# Altium schematic sheet decoupling.SchDoc
size A2
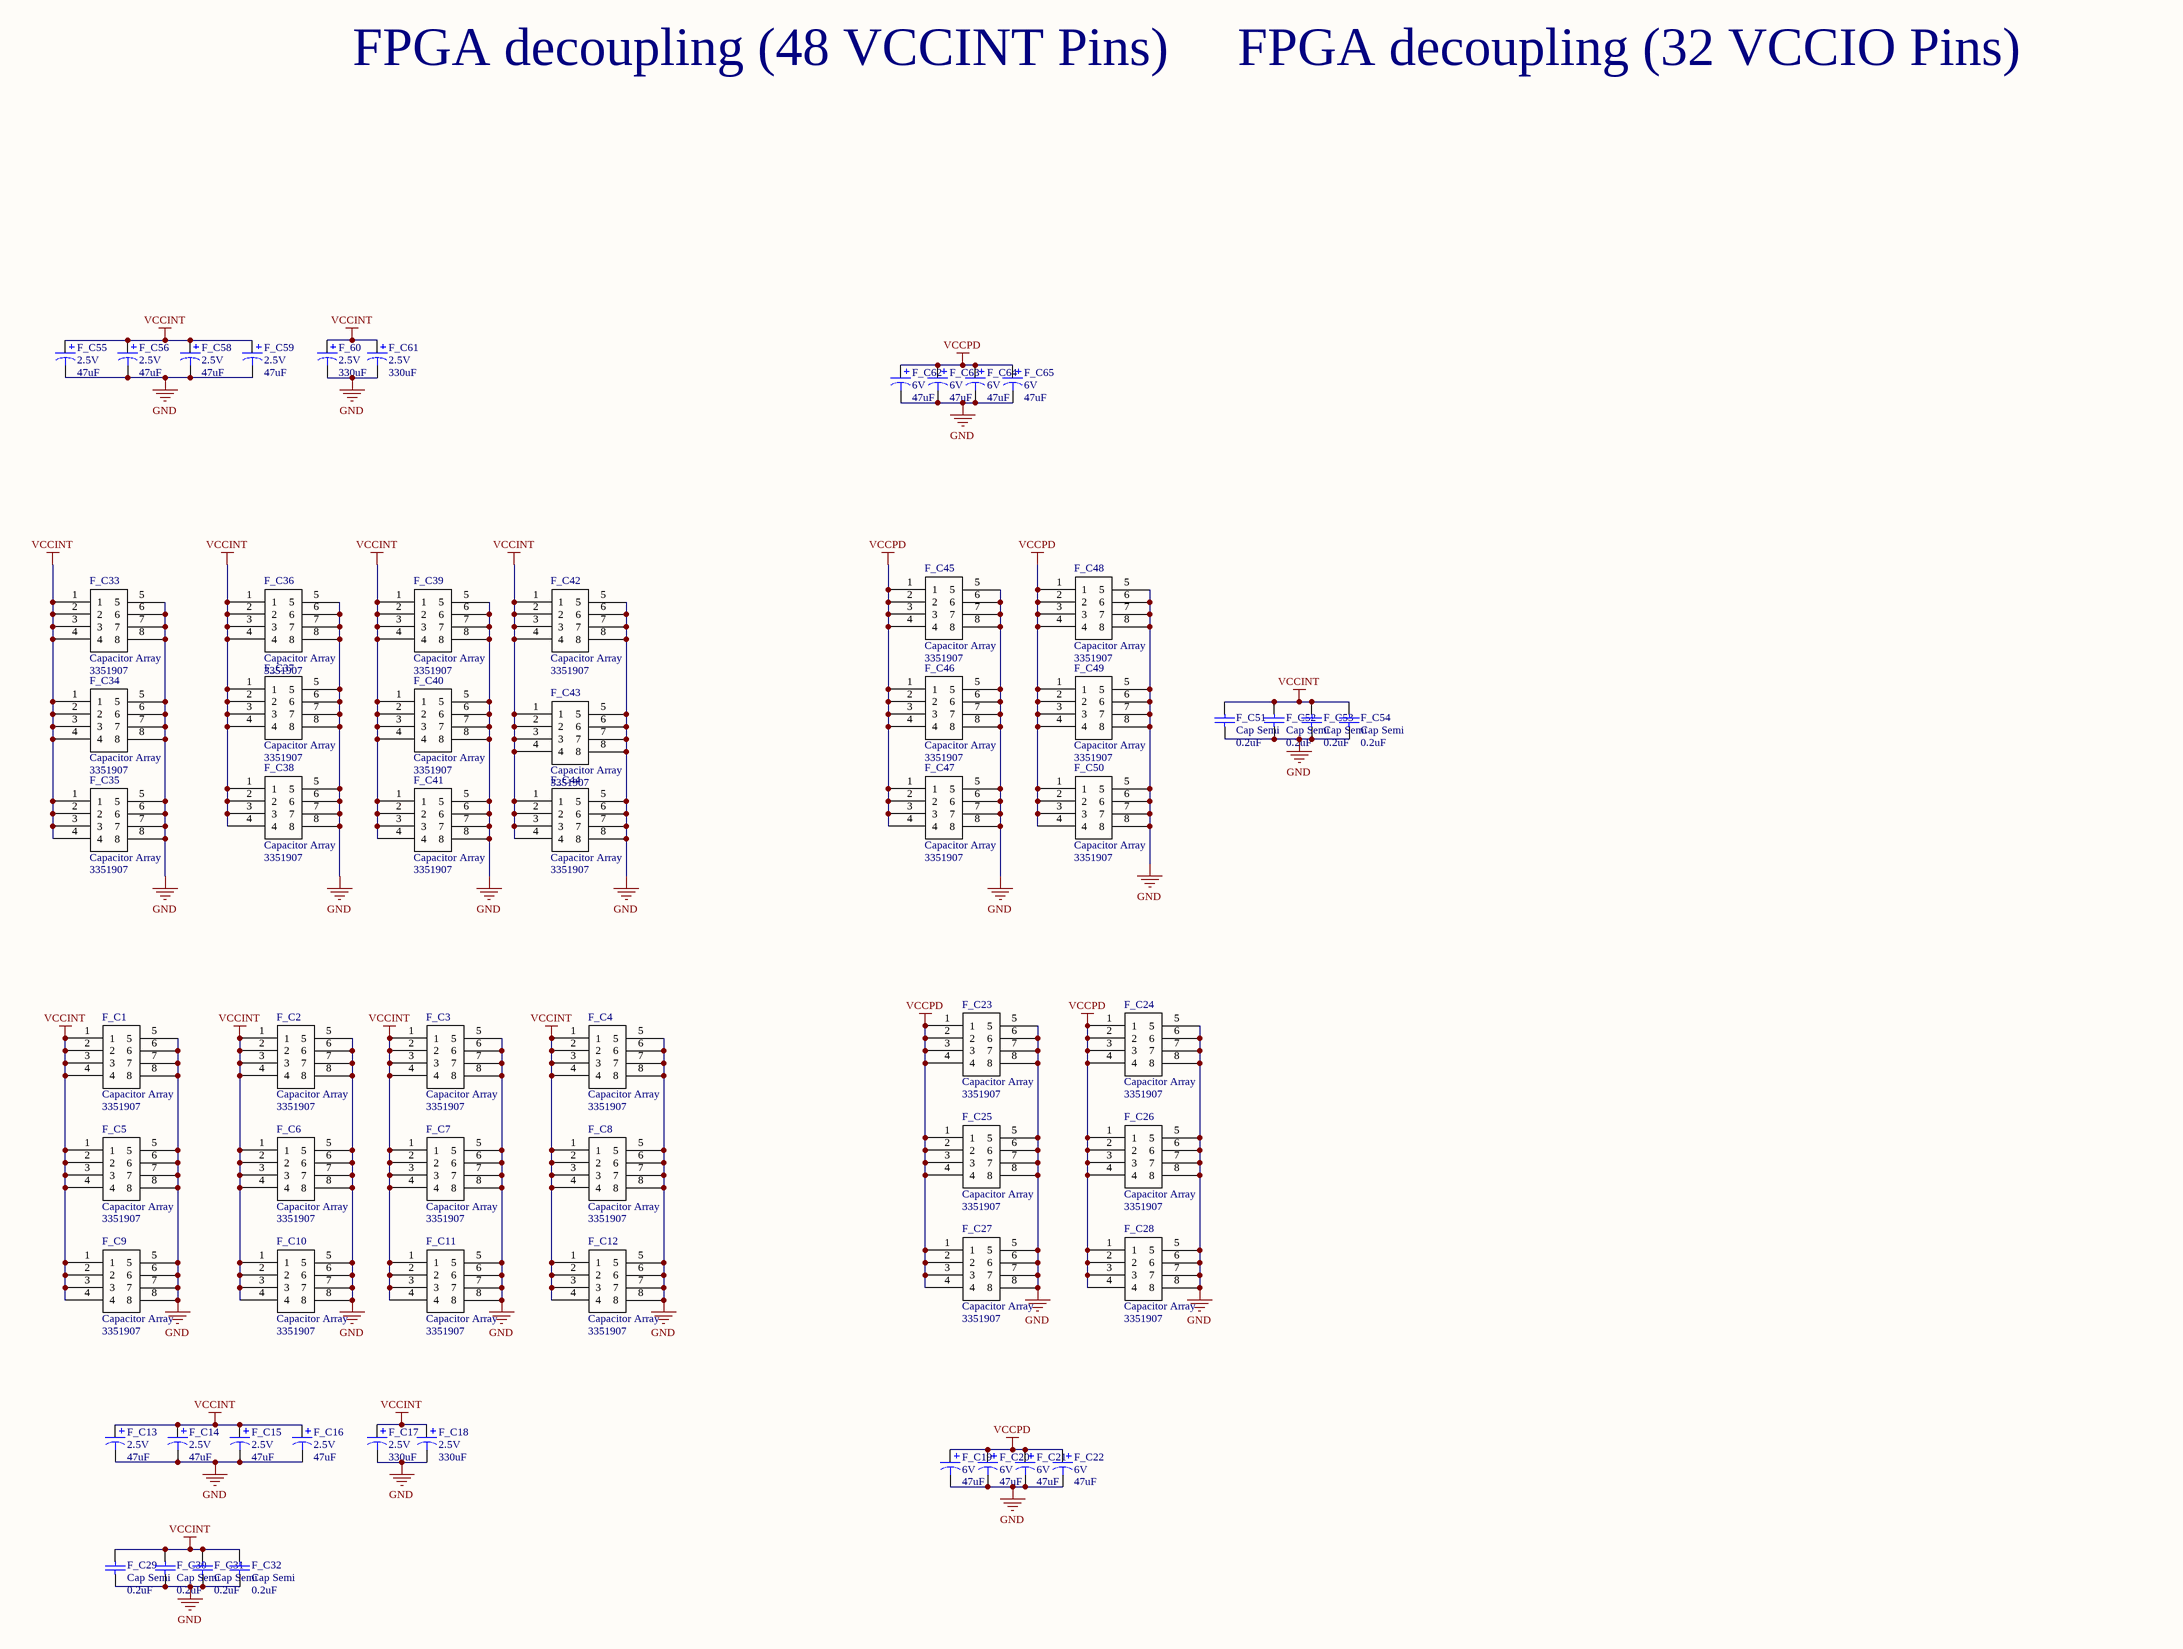
[diagram p0: decoupling.SchDoc]

## Parts
F_60  2.5V  value 330uF  [E]
F_C1  Capacitor Array  Supplier Part Number 1: 3351907  [0612 Array]
F_C2  Capacitor Array  Supplier Part Number 1: 3351907  [0612 Array]
F_C3  Capacitor Array  Supplier Part Number 1: 3351907  [0612 Array]
F_C4  Capacitor Array  Supplier Part Number 1: 3351907  [0612 Array]
F_C5  Capacitor Array  Supplier Part Number 1: 3351907  [0612 Array]
F_C6  Capacitor Array  Supplier Part Number 1: 3351907  [0612 Array]
F_C7  Capacitor Array  Supplier Part Number 1: 3351907  [0612 Array]
F_C8  Capacitor Array  Supplier Part Number 1: 3351907  [0612 Array]
F_C9  Capacitor Array  Supplier Part Number 1: 3351907  [0612 Array]
F_C10  Capacitor Array  Supplier Part Number 1: 3351907  [0612 Array]
F_C11  Capacitor Array  Supplier Part Number 1: 3351907  [0612 Array]
F_C12  Capacitor Array  Supplier Part Number 1: 3351907  [0612 Array]
F_C13  2.5V  value 47uF  [C]
F_C14  2.5V  value 47uF  [C]
F_C15  2.5V  value 47uF  [C]
F_C16  2.5V  value 47uF  [C]
F_C17  2.5V  value 330uF  [E]
F_C18  2.5V  value 330uF  [E]
F_C19  6V  value 47uF  [C]
F_C20  6V  value 47uF  [C]
F_C21  6V  value 47uF  [C]
F_C22  6V  value 47uF  [C]
F_C23  Capacitor Array  Supplier Part Number 1: 3351907  [0612 Array]
F_C24  Capacitor Array  Supplier Part Number 1: 3351907  [0612 Array]
F_C25  Capacitor Array  Supplier Part Number 1: 3351907  [0612 Array]
F_C26  Capacitor Array  Supplier Part Number 1: 3351907  [0612 Array]
F_C27  Capacitor Array  Supplier Part Number 1: 3351907  [0612 Array]
F_C28  Capacitor Array  Supplier Part Number 1: 3351907  [0612 Array]
F_C29  Cap Semi  value 0.2uF  [CAPC1608L]
F_C30  Cap Semi  value 0.2uF  [CAPC1608L]
F_C31  Cap Semi  value 0.2uF  [CAPC1608L]
F_C32  Cap Semi  value 0.2uF  [CAPC1608L]
F_C33  Capacitor Array  Supplier Part Number 1: 3351907  [0612 Array]
F_C34  Capacitor Array  Supplier Part Number 1: 3351907  [0612 Array]
F_C35  Capacitor Array  Supplier Part Number 1: 3351907  [0612 Array]
F_C36  Capacitor Array  Supplier Part Number 1: 3351907  [0612 Array]
F_C37  Capacitor Array  Supplier Part Number 1: 3351907  [0612 Array]
F_C38  Capacitor Array  Supplier Part Number 1: 3351907  [0612 Array]
F_C39  Capacitor Array  Supplier Part Number 1: 3351907  [0612 Array]
F_C40  Capacitor Array  Supplier Part Number 1: 3351907  [0612 Array]
F_C41  Capacitor Array  Supplier Part Number 1: 3351907  [0612 Array]
F_C42  Capacitor Array  Supplier Part Number 1: 3351907  [0612 Array]
F_C43  Capacitor Array  Supplier Part Number 1: 3351907  [0612 Array]
F_C44  Capacitor Array  Supplier Part Number 1: 3351907  [0612 Array]
F_C45  Capacitor Array  Supplier Part Number 1: 3351907  [0612 Array]
F_C46  Capacitor Array  Supplier Part Number 1: 3351907  [0612 Array]
F_C47  Capacitor Array  Supplier Part Number 1: 3351907  [0612 Array]
F_C48  Capacitor Array  Supplier Part Number 1: 3351907  [0612 Array]
F_C49  Capacitor Array  Supplier Part Number 1: 3351907  [0612 Array]
F_C50  Capacitor Array  Supplier Part Number 1: 3351907  [0612 Array]
F_C51  Cap Semi  value 0.2uF  [CAPC1608L]
F_C52  Cap Semi  value 0.2uF  [CAPC1608L]
F_C53  Cap Semi  value 0.2uF  [CAPC1608L]
F_C54  Cap Semi  value 0.2uF  [CAPC1608L]
F_C55  2.5V  value 47uF  [C]
F_C56  2.5V  value 47uF  [C]
F_C58  2.5V  value 47uF  [C]
F_C59  2.5V  value 47uF  [C]
F_C61  2.5V  value 330uF  [E]
F_C62  6V  value 47uF  [C]
F_C63  6V  value 47uF  [C]
F_C64  6V  value 47uF  [C]
F_C65  6V  value 47uF  [C]

## Nets
GND: F_60.2 F_C1.5 F_C1.6 F_C1.7 F_C1.8 F_C2.5 F_C2.6 F_C2.7 F_C2.8 F_C3.5 F_C3.6 F_C3.7 F_C3.8 F_C4.5 F_C4.6 F_C4.7 F_C4.8 F_C5.5 F_C5.6 F_C5.7 F_C5.8 F_C6.5 F_C6.6 F_C6.7 F_C6.8 F_C7.5 F_C7.6 F_C7.7 F_C7.8 F_C8.5 F_C8.6 F_C8.7 F_C8.8 F_C9.5 F_C9.6 F_C9.7 F_C9.8 F_C10.5 F_C10.6 F_C10.7 F_C10.8 F_C11.5 F_C11.6 F_C11.7 F_C11.8 F_C12.5 F_C12.6 F_C12.7 F_C12.8 F_C13.2 F_C14.2 F_C15.2 F_C16.2 F_C17.2 F_C18.2 F_C19.2 F_C20.2 F_C21.2 F_C22.2 F_C23.5 F_C23.6 F_C23.7 F_C23.8 F_C24.5 F_C24.6 F_C24.7 F_C24.8 F_C25.5 F_C25.6 F_C25.7 F_C25.8 F_C26.5 F_C26.6 F_C26.7 F_C26.8 F_C27.5 F_C27.6 F_C27.7 F_C27.8 F_C28.5 F_C28.6 F_C28.7 F_C28.8 F_C29.2 F_C30.2 F_C31.2 F_C32.2 F_C33.5 F_C33.6 F_C33.7 F_C33.8 F_C34.5 F_C34.6 F_C34.7 F_C34.8 F_C35.5 F_C35.6 F_C35.7 F_C35.8 F_C36.5 F_C36.6 F_C36.7 F_C36.8 F_C37.5 F_C37.6 F_C37.7 F_C37.8 F_C38.5 F_C38.6 F_C38.7 F_C38.8 F_C39.5 F_C39.6 F_C39.7 F_C39.8 F_C40.5 F_C40.6 F_C40.7 F_C40.8 F_C41.5 F_C41.6 F_C41.7 F_C41.8 F_C42.5 F_C42.6 F_C42.7 F_C42.8 F_C43.5 F_C43.6 F_C43.7 F_C43.8 F_C44.5 F_C44.6 F_C44.7 F_C44.8 F_C45.5 F_C45.6 F_C45.7 F_C45.8 F_C46.5 F_C46.6 F_C46.7 F_C46.8 F_C47.5 F_C47.6 F_C47.7 F_C47.8 F_C48.5 F_C48.6 F_C48.7 F_C48.8 F_C49.5 F_C49.6 F_C49.7 F_C49.8 F_C50.5 F_C50.6 F_C50.7 F_C50.8 F_C51.2 F_C52.2 F_C53.2 F_C54.2 F_C55.2 F_C56.2 F_C58.2 F_C59.2 F_C61.2 F_C62.2 F_C63.2 F_C64.2 F_C65.2
VCCINT: F_60.1 F_C1.1 F_C1.2 F_C1.3 F_C1.4 F_C2.1 F_C2.2 F_C2.3 F_C2.4 F_C3.1 F_C3.2 F_C3.3 F_C3.4 F_C4.1 F_C4.2 F_C4.3 F_C4.4 F_C5.1 F_C5.2 F_C5.3 F_C5.4 F_C6.1 F_C6.2 F_C6.3 F_C6.4 F_C7.1 F_C7.2 F_C7.3 F_C7.4 F_C8.1 F_C8.2 F_C8.3 F_C8.4 F_C9.1 F_C9.2 F_C9.3 F_C9.4 F_C10.1 F_C10.2 F_C10.3 F_C10.4 F_C11.1 F_C11.2 F_C11.3 F_C11.4 F_C12.1 F_C12.2 F_C12.3 F_C12.4 F_C13.1 F_C14.1 F_C15.1 F_C16.1 F_C17.1 F_C18.1 F_C29.1 F_C30.1 F_C31.1 F_C32.1 F_C33.1 F_C33.2 F_C33.3 F_C33.4 F_C34.1 F_C34.2 F_C34.3 F_C34.4 F_C35.1 F_C35.2 F_C35.3 F_C35.4 F_C36.1 F_C36.2 F_C36.3 F_C36.4 F_C37.1 F_C37.2 F_C37.3 F_C37.4 F_C38.1 F_C38.2 F_C38.3 F_C38.4 F_C39.1 F_C39.2 F_C39.3 F_C39.4 F_C40.1 F_C40.2 F_C40.3 F_C40.4 F_C41.1 F_C41.2 F_C41.3 F_C41.4 F_C42.1 F_C42.2 F_C42.3 F_C42.4 F_C43.1 F_C43.2 F_C43.3 F_C43.4 F_C44.1 F_C44.2 F_C44.3 F_C44.4 F_C51.1 F_C52.1 F_C53.1 F_C54.1 F_C55.1 F_C56.1 F_C58.1 F_C59.1 F_C61.1
VCCPD: F_C19.1 F_C20.1 F_C21.1 F_C22.1 F_C23.1 F_C23.2 F_C23.3 F_C23.4 F_C24.1 F_C24.2 F_C24.3 F_C24.4 F_C25.1 F_C25.2 F_C25.3 F_C25.4 F_C26.1 F_C26.2 F_C26.3 F_C26.4 F_C27.1 F_C27.2 F_C27.3 F_C27.4 F_C28.1 F_C28.2 F_C28.3 F_C28.4 F_C45.1 F_C45.2 F_C45.3 F_C45.4 F_C46.1 F_C46.2 F_C46.3 F_C46.4 F_C47.1 F_C47.2 F_C47.3 F_C47.4 F_C48.1 F_C48.2 F_C48.3 F_C48.4 F_C49.1 F_C49.2 F_C49.3 F_C49.4 F_C50.1 F_C50.2 F_C50.3 F_C50.4 F_C62.1 F_C63.1 F_C64.1 F_C65.1

## Notes on the sheet
- FPGA decoupling (48 VCCINT Pins)
- FPGA decoupling (32 VCCIO Pins)

## Library data of the parts
F_60 F_C13-F_C22 F_C55 F_C56 F_C58 F_C59 F_C61-F_C65 = Cap Pol3: Polarized Capacitor (Surface Mount); Published: 8-Jun-2000; LatestRevisionDate: 29-May-2009; LatestRevisionNote: IPC-7351 Footprint Added.; PackageReference: C0805; Publisher: Altium Limited; PackageDescription: Chip Capacitor
F_C1-F_C12 F_C23-F_C28 = Capacitor Array: Array of 4x47nF; Capacitance: 47nF; Supplier 1: Farnell
F_C29-F_C32 F_C51-F_C54 = Cap Semi: Capacitor (Semiconductor SIM Model); Published: 8-Jun-2000; LatestRevisionDate: 29-May-2009; LatestRevisionNote: IPC-7351 Footprint Added.; PackageReference: C1206; Publisher: Altium Limited; PackageDescription: Chip Capacitor
F_C33-F_C50 = Capacitor Array: Supplier 1: Farnell